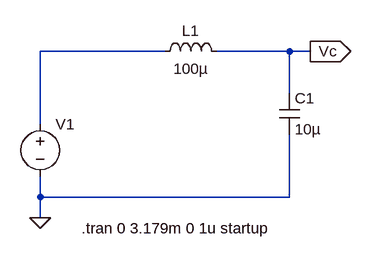
[diagram p0: schematic LC2.asc]
LC2.asc, the LTspice schematic file:
Version 4
SHEET 1 880 680
WIRE 352 176 160 176
WIRE 544 176 432 176
WIRE 576 176 544 176
WIRE 544 240 544 176
WIRE 160 288 160 176
WIRE 160 400 160 368
WIRE 544 400 544 304
WIRE 544 400 160 400
WIRE 160 432 160 400
FLAG 576 176 Vc
IOPIN 576 176 Out
FLAG 160 432 0
SYMBOL voltage 160 272 R0
WINDOW 3 24 96 Invisible 2
SYMATTR InstName V1
SYMATTR Value PULSE(0 1 0 1u 1u 3.179 6.358)
SYMBOL ind 336 192 R270
WINDOW 0 32 56 VTop 2
WINDOW 3 5 56 VBottom 2
SYMATTR InstName L1
SYMATTR Value 100µ
SYMATTR SpiceLine Ipk=1 Rser=85m Rpar=infin. Cpar=0 mfg="Coiltronics" pn="CTX100-1-52"
SYMBOL cap 528 240 R0
SYMATTR InstName C1
SYMATTR Value 10µ
TEXT 224 448 Left 2 !.tran 0 3.179m 0 1u startup

The netlist it stands for:
* LC2.asc
V1 N001 0 PULSE(0 1 0 1u 1u 3.179 6.358)
L1 N001 Vc 100µ Ipk=1 Rser=85m Rpar=infin. Cpar=0 mfg="Coiltronics" pn="CTX100-1-52"
C1 Vc 0 10µ
.tran 0 3.179m 0 1u startup
.backanno
.end